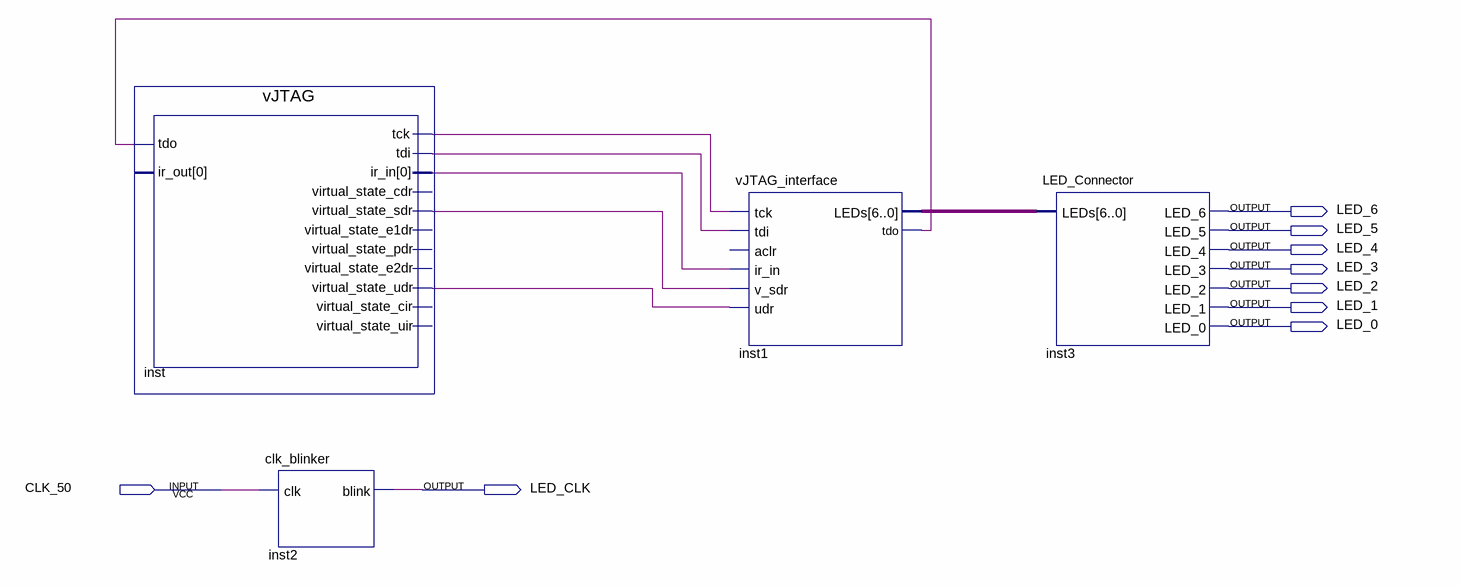
[diagram p0: schematic sheet]
// Quartus schematic InitialTest.bdf as structural Verilog: 4 symbols, 9 pins
module InitialTest (
  input  CLK_50,
  output LED_6,
  output LED_5,
  output LED_4,
  output LED_3,
  output LED_2,
  output LED_1,
  output LED_0,
  output LED_CLK
);

  wire inst1_tdo, inst_ir_in, inst_tck, inst_tdi, inst_virtual_state_sdr, inst_virtual_state_udr;
  wire [6:0] inst1_leds;

  vJTAG inst (
    .tdo(inst1_tdo), .tck(inst_tck), .tdi(inst_tdi), .ir_in(inst_ir_in),
    .virtual_state_sdr(inst_virtual_state_sdr), .virtual_state_udr(inst_virtual_state_udr));  // open: ir_out, virtual_state_cdr, virtual_state_e1dr, virtual_state_pdr, virtual_state_e2dr, virtual_state_cir, virtual_state_uir
  clk_blinker inst2 (.clk(CLK_50), .blink(LED_CLK));
  vJTAG_interface inst1 (
    .tck(inst_tck), .tdi(inst_tdi), .ir_in(inst_ir_in), .v_sdr(inst_virtual_state_sdr),
    .udr(inst_virtual_state_udr), .LEDs(inst1_leds), .tdo(inst1_tdo));  // open: aclr
  LED_Connector inst3 (
    .LEDs(inst1_leds), .LED_6(LED_6), .LED_5(LED_5), .LED_4(LED_4), .LED_3(LED_3), .LED_2(LED_2),
    .LED_1(LED_1), .LED_0(LED_0));
endmodule
